# Altium schematic sheet LED_Validation_Board_pg_1.SchDoc
size A4; SheetNumber: 1; SheetTotal: 2
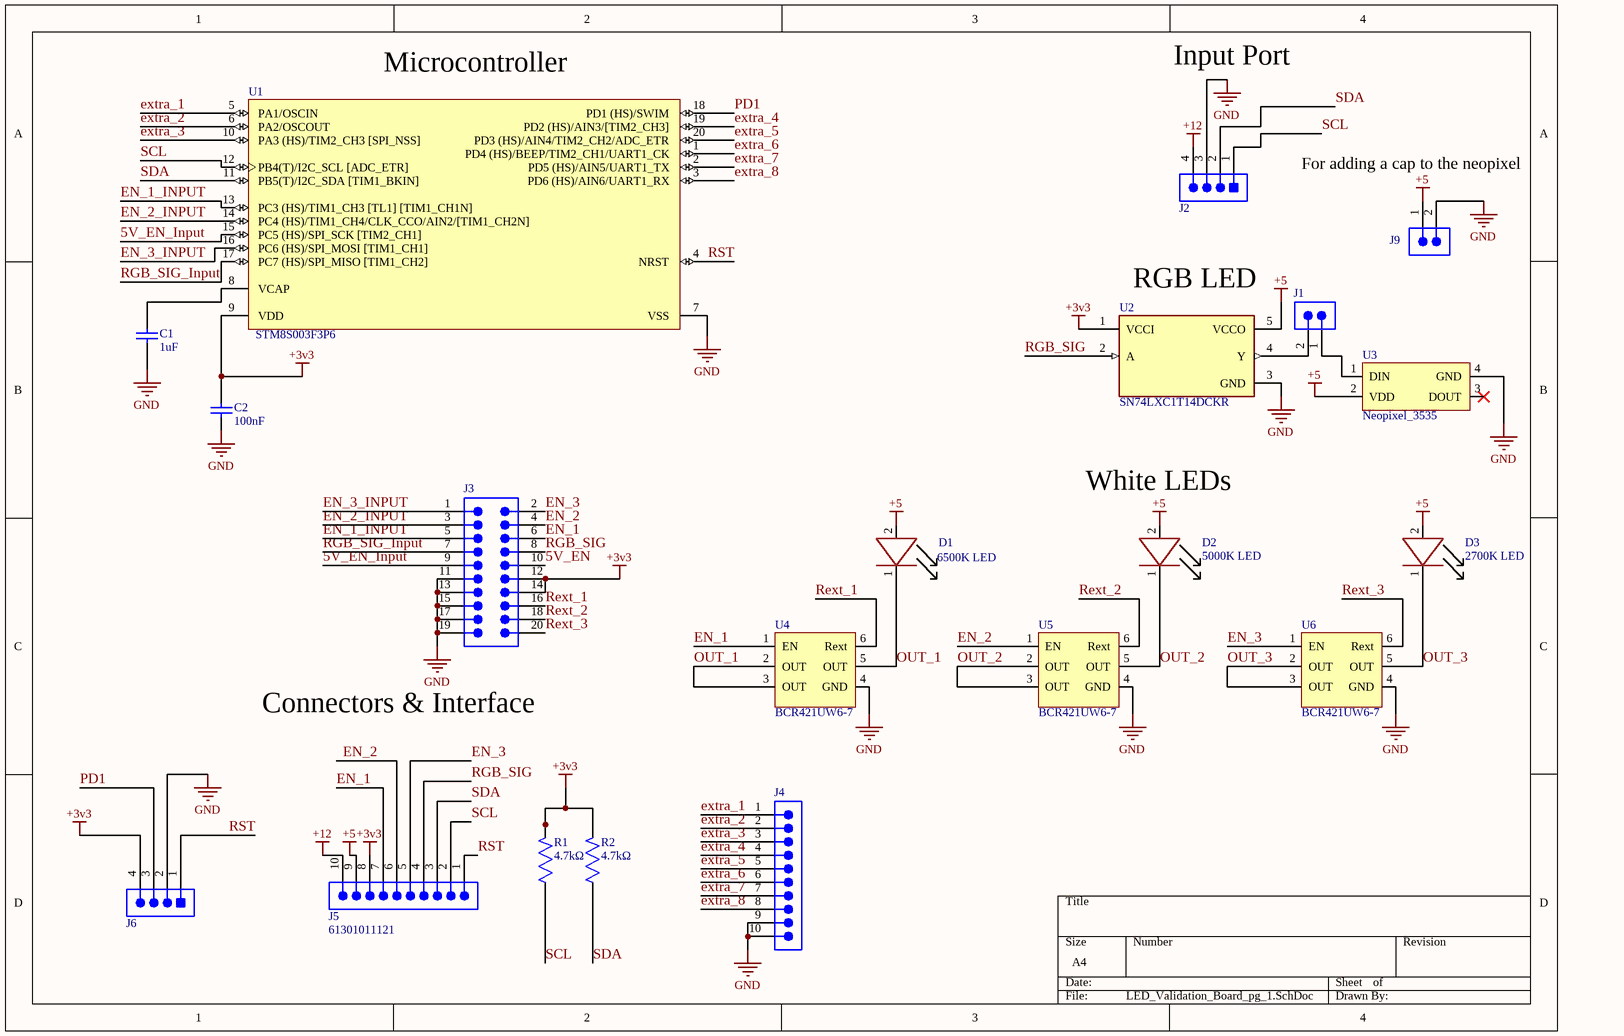
[diagram p0: LED_Validation_Board_pg_1.SchDoc]

## Parts
C1  1uF  [0402 PACKAGE]
C2  100nF  [0402 PACKAGE]
D1  6500K LED  [2424 Package]
D2  5000K LED  [2424 Package]
D3  2700K LED  [2424 Package]
J1  TSW-102-26-F-S  [SMTC-TSW-102-26-XX-S]  (value not drawn)
J2  640445-4  [TECO-640445-4_V]  (value not drawn)
J3  61302021121  [61302021121]  (value not drawn)
J4  61301011121  [61301011121]  (value not drawn)
J5  61301011121  [61301011121]
J6  640445-4  [TECO-640445-4_V]  (value not drawn)
J9  TSW-102-26-F-S  [SMTC-TSW-102-26-XX-S]  (value not drawn)
R1  4.7kΩ  [0402 PACKAGE]
R2  4.7kΩ  [0402 PACKAGE]
U1  STM8S003F3P6  [STM-TSSOP20_V]
U2  SN74LXC1T14DCKR  [FP-DCK0005A-MFG]
U3  Neopixel_3535  [Neopixel]
U4  BCR421UW6-7  [SOT95P280X140-6N]
U5  BCR421UW6-7  [SOT95P280X140-6N]
U6  BCR421UW6-7  [SOT95P280X140-6N]

## Nets
+3v3: C2.2 J3.12 J3.14 J5.8 J6.4 R1.2 R2.2 U1.9(VDD) U2.1(VCCI)
+5: D1.2 D2.2 D3.2 J5.9 J9.1 U2.5(VCCO) U3.2(VDD)
+12: J2.4 J5.10
GND: C1.1 C2.1 J2.3 J3.11 J3.13 J3.15 J3.17 J3.19 J4.9 J4.10 J6.2 J9.2 U1.7(VSS) U2.3(GND) U3.4(GND) U4.4(GND) U5.4(GND) U6.4(GND)
5V_EN: J3.10
5V_EN_Input: J3.9 U1.15(PC5_(HS)/SPI_SCK_[TIM2_CH1])
EN_1: J3.6 J5.7 U4.1(EN)
EN_1_INPUT: J3.5 U1.13(PC3_(HS)/TIM1_CH3_[TL1]_[TIM1_CH1N])
EN_2: J3.4 J5.6 U5.1(EN)
EN_2_INPUT: J3.3 U1.14(PC4_(HS)/TIM1_CH4/CLK_CCO/AIN2/[TIM1_CH2N])
EN_3: J3.2 J5.5 U6.1(EN)
EN_3_INPUT: J3.1 U1.16(PC6_(HS)/SPI_MOSI_[TIM1_CH1])
extra_1: J4.1 U1.5(PA1/OSCIN)
extra_2: J4.2 U1.6(PA2/OSCOUT)
extra_3: J4.3 U1.10(PA3_(HS)/TIM2_CH3_[SPI_NSS])
extra_4: J4.4 U1.19(PD2_(HS)/AIN3/[TIM2_CH3])
extra_5: J4.5 U1.20(PD3_(HS)/AIN4/TIM2_CH2/ADC_ETR)
extra_6: J4.6 U1.1(PD4_(HS)/BEEP/TIM2_CH1/UART1_CK)
extra_7: J4.7 U1.2(PD5_(HS)/AIN5/UART1_TX)
extra_8: J4.8 U1.3(PD6_(HS)/AIN6/UART1_RX)
OUT_1: D1.1 U4.2(OUT) U4.3(OUT) U4.5(OUT)
OUT_2: D2.1 U5.2(OUT) U5.3(OUT) U5.5(OUT)
OUT_3: D3.1 U6.2(OUT) U6.3(OUT) U6.5(OUT)
PD1: J6.3 U1.18(PD1_(HS)/SWIM)
Rext_1: J3.16 U4.6(Rext)
Rext_2: J3.18 U5.6(Rext)
Rext_3: J3.20 U6.6(Rext)
RGB_SIG: J3.8 J5.4 U2.2(A)
RGB_SIG_Input: J3.7 U1.17(PC7_(HS)/SPI_MISO_[TIM1_CH2])
RST: J5.1 J6.1 U1.4(NRST)
SCL: J2.1 J5.2 R1.1 U1.12(PB4(T)/I2C_SCL_[ADC_ETR])
SDA: J2.2 J5.3 R2.1 U1.11(PB5(T)/I2C_SDA_[TIM1_BKIN])
NetC1_2: C1.2 U1.8(VCAP)
NetJ1_1: J1.1 U3.1(DIN)
NetJ1_2: J1.2 U2.4(Y)

Not connected (* = marked no-connect by the designer): U3 3(DOUT)*

## Notes on the sheet
- (near U1) Microcontroller
- Input Port
- For adding a cap to the neopixel
- (near U2) RGB LED
- (near D2) White LEDs
- Connectors & Interface

## Library data of the parts
C1 = Capacitor: CAP CER 1UF 10V X5R 0402
C2 = Capacitor: CAP CER 0.1UF 10V X5R 0402
J1 J9 = CMP-1024-00329-1: 0.025" SQ Post Header, Through-hole, Vertical, -55 to 125 degC, 2.54 mm Pitch, 2-Pin, Male, RoHS; Manufacturer: Samtec; Pitch: 2.54 mm; PackageVersion: DM, 8/1988; ComponentLink2Description: Datasheet; PackageReference: TSW-102-26-XX-S; ComponentLink3URL: http://www.samtec.com/documents/webfiles/cpdf/TSW-XXX-XX-XXX-X-XX-XXX-MKT.pdf; ComponentLink2URL: http://www.samtec.com/documents/webfiles/pdf/TSW_TH.PDF; ComponentLink1Description: Manufacturer URL; DatasheetVersion: F-214; RoHS: True; ComponentLink3Description: Package Specification; PartNumber: TSW-102-26-F-S; Temperature Range: -55 to 125 degC; Orientation: Vertical; ComponentLink1URL: http://www.samtec.com; PackageDescription: .025[0.64] SQ. Post Terminal Strip Assembly; Mounting Technology: Through-hole
J2 J6 = CMP-1684-00016-1: Male Header, Pitch 3.962 mm, 1 x 4 Postion, Height 13.716 mm, Tail Length 3.175 mm, -55 to 105 degC, RoHS; Manufacturer: TE Connectivity; Number of Contacts: 4; Contact Centerline Spacing: 0.156 / in.; Temperature, Operating: -55to+105 / °C; Mount Angle: Vertical; Primary Type: InterconnectSystem; Mounting Hole Size: 0.07 / "; Material, Contact: CopperAlloy; Special Features: IDC,Pinstrip; Agency Approvals: CSA,UL; Voltage, Rating: 600 / V; Pin Spacing: 0.156 / "; Standards: UL94V-0HousingFlammabilityRating,RoHSCompliant,ELVCompliant; Brand/Series: MTA-156Series; Current, Rating: 7 / A; Material, Housing: ThermoplasticPolyester; Angle: Straight; Color, Housing: White; Wire, AWG: 26-18; Package Description: Male Header, Pitch 3.962 mm, 1 x 4 Postion, Height 13.716 mm, Tail Length 3.175 mm; Color: White; Application: Forwire-to-board; Length, Terminal Post: 0.125 / in.; Datasheet Version: Rev. AD5; Manufacturer URL: http://www.te.com; Type: PCBPlug; Number of Positions: 4; Connector Type: Male; Package Reference: THD; Length, Overall: 0.624 / "; Mounting Type: PCBMount; Length, Pin: 0.125 / "; Number of Rows: 1; Flammability Rating: UL94V-0; Termination: Solder; Contact Plating: Tin; Datasheet URL: http://www.te.com/commerce/DocumentDelivery/DDEController?Action=showdoc&DocId=Customer+Drawing%7F640445%7FAD5%7Fpdf%7FEnglish%7FENG_CD_640445_AD5.pdf%7F640445-4; Diameter, Insulation: 0.095"(SingleWire),0.07"(MassTerminationWires)
J3 = CMP-1502-01104-3: NexarPartId: 32855556; Current Rating: 3A; Operating Supply Voltage: 250V; Contact Resistance: 20mΩ; Gender: Male; Number of Positions: 20; Connector Type: Male Pin; Row Spacing: 2.54mm; Contact Material: Copper; Number of Rows: 2; Lead Pitch: 2.54mm; Packaging: Bulk; Mount: Through Hole; Number of Pins: 20; Contact Mating Length: 5.9944mm; Number of Contacts: 20; Pitch: 2.54mm; Color: Black; Contact Plating: Gold; Orientation: Vertical; Termination: Solder; REACH SVHC: Unknown; RoHS: Compliant
J4 J5 = CMP-1502-01082-5: NexarPartId: 18818159; Gender: Male; Number of Positions: 10; Operating Supply Voltage: 250V; Current Rating: 3A; Contact Resistance: 20mΩ; Connector Type: Male Pin; Insulation Resistance: 1GΩ; Pitch: 2.54mm; Color: Black; Contact Gender: Male; Height: 8.74mm; Orientation: Vertical; RoHS: Compliant; Packaging: Bulk; Min Operating Temperature: -40°C; Number of Pins: 10; Max Operating Temperature: 105°C; REACH SVHC: Unknown; Voltage Rating: 250V; Number of Rows: 1; Housing Material: PBT; Number of Contacts: 10; Mount: Through Hole; Contact Mating Length: 5.9944mm; Length: 2.54mm; Lead Pitch: 2.54mm; Flammability Rating: UL94 V-0; Termination: Solder; Contact Material: Copper; Width: 25.4mm; Contact Plating: Gold
R1 R2 = Resistor
U1 = CMP-2000-07166-1: Value Line, 16 MHz STM8S 8-Bit MCU, 8 Kbyte Flash, 128 Byte Data EEPROM, 10-Bit ADC, 3 Timers, 2.95 to 5.5 V, -40 to 85 degC, 20-Pin TSSOP, RoHS, Tube; Manufacturer: STMicroelectronics; Connectivity: I²C,IrDA,LIN,SPI,UART/USART; Featured Product: FlasherSeriesofProductionTools; Program Memory Size: 8KB(8Kx8); Oscillator Type: Internal; Other Names: 497-11946-5; Core Processor: STM8; Package Version: Rev. 2, 01/2015; Peripherals: Brown-outDetect/Reset,POR,PWM,WDT; Data Converters: A/D5x10b; Other Related Documents: STM8S003F3ViewAllSpecifications; Number of I/Os: 16; EEPROM Size: 128x8; Speed: 16MHz; RAM Size: 1Kx8; Voltage - Supply (Vcc/Vdd): 2.95V~5.5V; Series: STM8S; Category: IntegratedCircuits(ICs); Program Memory Type: FLASH; Packaging: Tube; Datasheet Version: Rev. 8, 04/2016; Manufacturer URL: http://www.st.com/; Package URL: http://www.st.com/st-web-ui/static/active/en/resource/technical/document/datasheet/DM00141386.pdf; Operating Temperature: -40°C~85°C; Package / Case: 20-TSSOP(0.173",4.40mmWidth); Standard Package: 74; Family: Embedded-Microcontrollers; Datasheet URL: http://www2.st.com/content/ccc/resource/technical/document/datasheet/42/5a/27/87/ac/5a/44/88/DM00024550.pdf/files/DM00024550.pdf/jcr:content/translations/en.DM00024550.pdf; Package Description: 20-Pin Thin Shrink Small Outline Package, Body 6.5 x 4.4 mm, Pitch 0.65 mm; Core Size: 8-Bit; Package Reference: TSSOP20; Mounting Technology: SurfaceMount; Dynamic Catalog: STM8S; Number of I /O: 16
U2 = CMP-04899-000130-1: IC TRANSLATOR UNIDIR SC70-5
U4-U6 = BCR421UW6-7: LED Driver
D1 = 6500K LED: Supplier 1: Digikey; Supplier Part Number 1: 475-GWPLLRA1.CM-M7N2-XX53-1-700-R18CT-ND
D2 = 5000K LED: Supplier 1: Digikey; Supplier Part Number 1: 475-GWPLLRA1.CM-M7N2-XX51-1-700-R18CT-ND
D3 = 2700K LED: Supplier 1: Digikey; Supplier Part Number 1: 475-GWPLLRA1.CM-M3M8-XX58-1-700-R18CT-ND